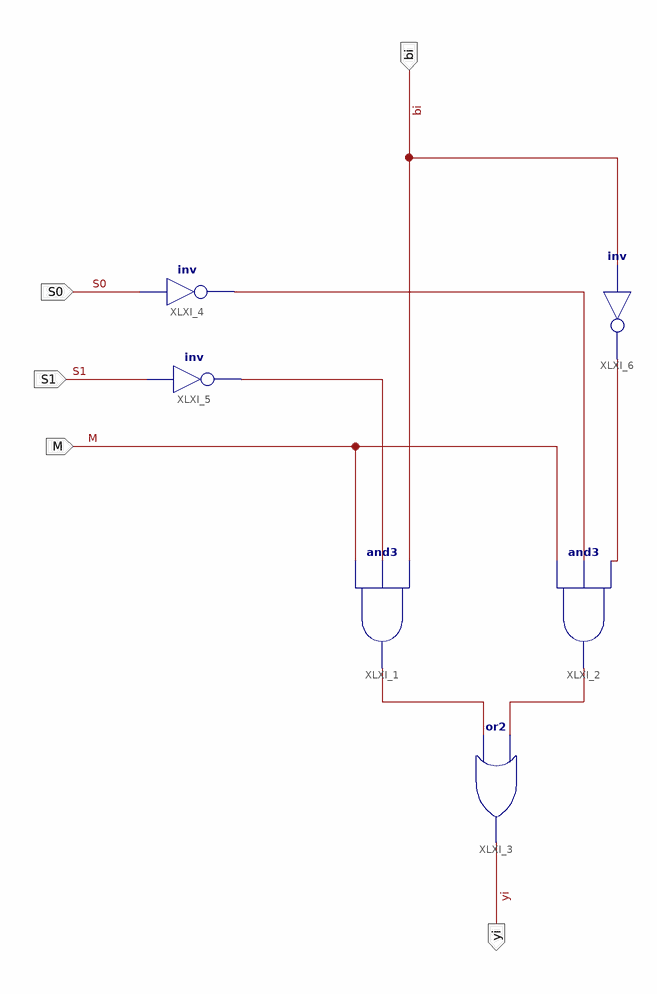
[diagram p0: schematic sheet 1]
// Xilinx ISE schematic arith_ext.sch (spartan3e) as structural Verilog: 6 symbols, 5 ports
module arith_ext (
  input  bi,
  input  M,
  input  S1,
  input  S0,
  output yi
);

  wire XLXN_5, XLXN_9, XLXN_10, XLXN_14, XLXN_15;

  not XLXI_6 (XLXN_10, bi);
  not XLXI_5 (XLXN_9, S1);
  not XLXI_4 (XLXN_5, S0);
  or XLXI_3 (yi, XLXN_14, XLXN_15);
  and XLXI_2 (XLXN_15, M, XLXN_5, XLXN_10);
  and XLXI_1 (XLXN_14, M, XLXN_9, bi);
endmodule
